# EAGLE design IMU Breakout Board (EAGLE 9.5.0)
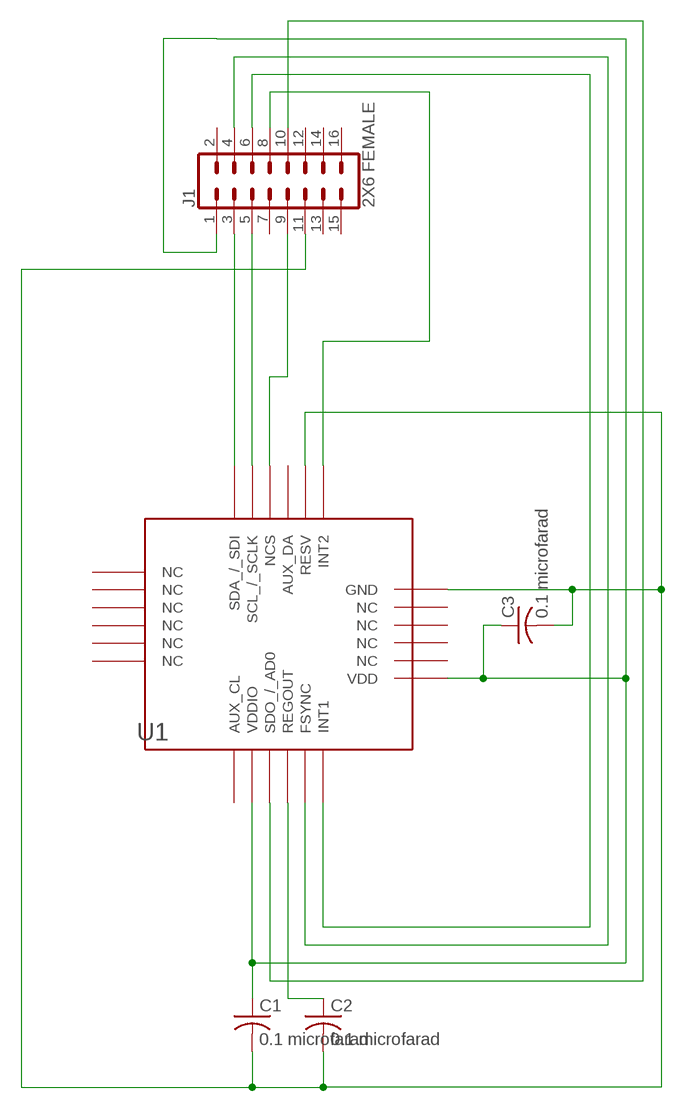
[diagram p0: schematic, sheet 1]

## Parts
C1  0.1 microfarad  C-ALL_PACKAGESC1206  [C1206]
C2  0.1 microfarad  C-ALL_PACKAGESC1206  [C1206]
C3  0.1 microfarad  C-ALL_PACKAGESC1206  [C1206]
J1  2X6 FEMALE  SENSOR_BREAKOUTPTH_FEMALE  [2X7]
U1  ICM_20649  [ICM-20649]

## Nets
N$1: J1.4 U1.P4(FSYNC)
N$2: J1.6 U1.P5(INT1)
N$3: J1.8 U1.P6(INT2)
N$4: J1.9 U1.P9(NCS)
N$5: J1.3 U1.P11(SDA_/_SDI)
N$6: J1.5 U1.P10(SCL_/_SCLK)
N$7: J1.10 U1.P2(SDO_/_AD0)
N$8: C1.1 C3.1 J1.1 U1.P1(VDDIO) U1.P18(VDD)
N$9: C2.1 U1.P3(REGOUT)
N$11: C1.2 C2.2 C3.2 J1.11 U1.P7(RESV) U1.P23(GND)
Unconnected: J1.2 J1.7 J1.12 J1.13 J1.14 J1.15 J1.16 U1.P0(AUX_CL) U1.P8(AUX_DA) U1.P12(NC) U1.P13(NC) U1.P14(NC) U1.P15(NC) U1.P16(NC) U1.P17(NC) U1.P19(NC) U1.P20(NC) U1.P21(NC) U1.P22(NC)

## Library data of the parts
C1-C3 = RTR Main Library:C-ALL_PACKAGES: CAPACITOR, American symbol
J1 = RTR Main Library:SENSOR_BREAKOUT: .1 inch-spaced 12P sensor breakout Used as a generalized connector for attaching new sensors; PROD_ID: CONN-12423
U1 = IMU_Breakout_SCH_E:ICM_20649

## Board
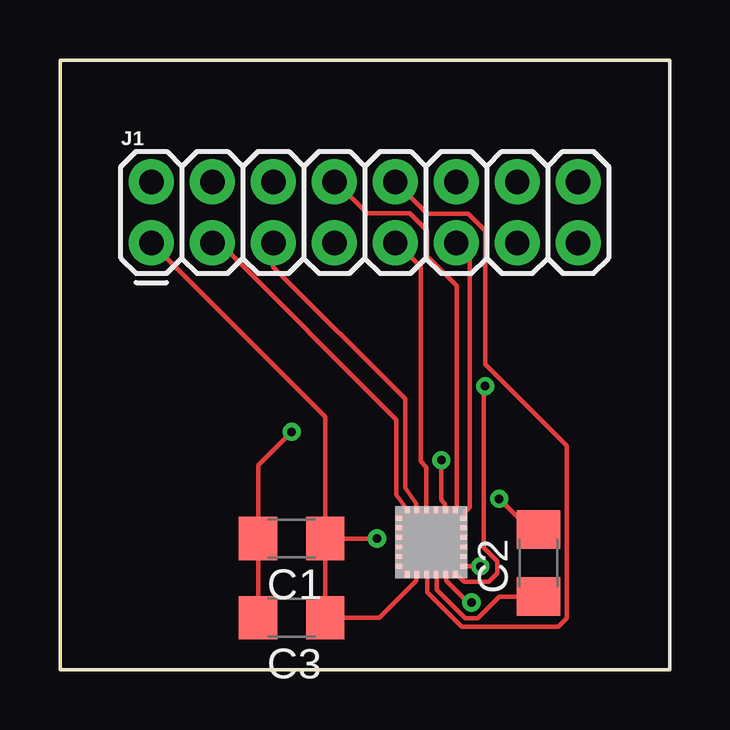
[diagram p1: board, top side]
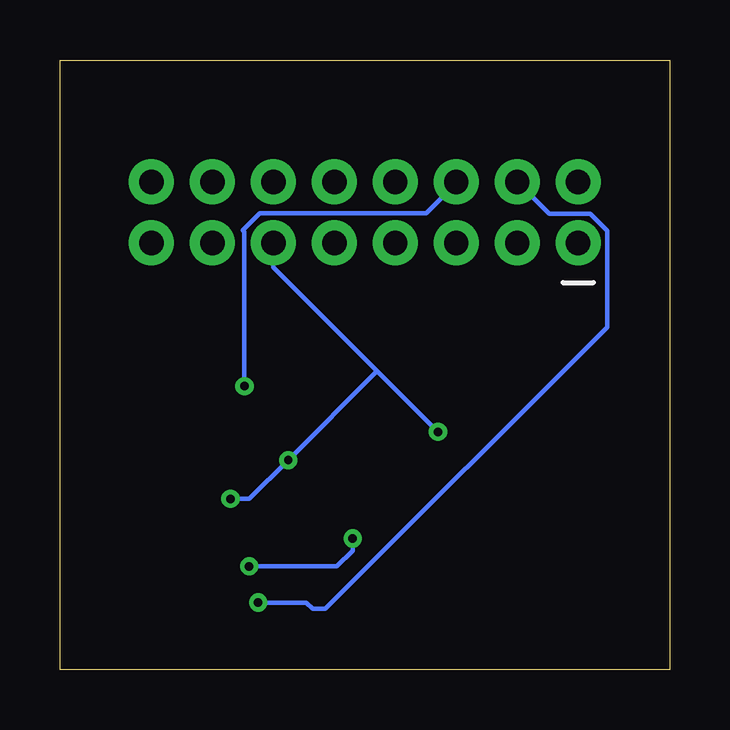
[diagram p2: board, bottom side, seen from below]

Size 25.4 x 25.4 mm. Coordinates in mm from the lower left corner, seen from the top.
Outline: 0,0 25.4,0 25.4,25.4 0,25.4 0,0
Copper layers (1*16): Top 0.035mm / dielectric 1.5mm / Bottom 0.035mm
Design rules "Bantam PCB Mill Design Rules *": minimum track width 7mil, minimum drill 11mil, track to track 7mil, track to pad 7mil, pad to pad 5mil, via to via 7mil, smd to smd 5mil, copper to edge 40mil, drill to drill 6mil, minimum pad ring 10mil, minimum via ring 8mil, stop-mask expansion 4mil, vias tented up to drill 0mil, thermal gap 10mil

### Footprints (pad centres in the part's own frame; a part is rotated, then mirrored left to right if it is on the bottom)
C1206 = smd 1.6 x 1.8: 1 -1.4,0; 2 1.4,0
2X7 = drill 1.016 pad 1.88: 1 -8.89,5.08; 2 -8.89,7.62; 3 -6.35,5.08; 4 -6.35,7.62; 5 -3.81,5.08; 6 -3.81,7.62; 7 -1.27,5.08; 8 -1.27,7.62; 9 1.27,5.08; 10 1.27,7.62; 11 3.81,5.08; 12 3.81,7.62; 13 6.35,5.08; 14 6.35,7.62; 15 8.89,5.08; 16 8.89,7.62
ICM-20649 = smd 0.2 x 0.3: P0 0.5,0.15; P1 0.9,0.15; P2 1.3,0.15; P3 1.7,0.15; P4 2.1,0.15; P5 2.5,0.15; P6 2.5,2.85; P7 2.1,2.85; P8 1.7,2.85; P9 1.3,2.85; P10 0.9,2.85; P11 0.5,2.85 | smd 0.3 x 0.2: P12 0.15,2.5; P13 0.15,2.1; P14 0.15,1.7; P15 0.15,1.3; P16 0.15,0.9; P17 0.15,0.5; P18 2.85,0.5; P19 2.85,0.9; P20 2.85,1.3; P21 2.85,1.7; P22 2.85,2.1; P23 2.85,2.5

### Placement (x,y rotation side)
C1  9.65,5.46 180 top
C2  19.94,4.45 90 top
C3  9.65,2.16 180 top
J1  12.7,12.7 0 top
U1  13.97,3.81 0 top

### Tracks (layer width: path | path; a pad name or v marks a point on that pad's centre or on a via)
N$1  (via drill 0.35)
  Top 0.178: U1.P4 16.1,3.93 16.1,3.7 17.01,2.79 v17.14,2.79
  Bottom 0.178: v17.14,2.79 15.14,2.79 14.87,2.53 14.34,2.53 2.6,14.26 2.6,18.28 3.31,18.99 5.02,18.99 J1.4
N$2  (via drill 0.35)
  Top 0.178: U1.P5 16.54,3.96 16.84,3.66 17.86,3.66 18.21,4.01 18.21,4.52 17.65,5.08 17.65,11.75 v17.71,11.81
  Bottom 0.178: J1.6 8.89,20.27 10.13,19.02 17.07,19.02 17.78,18.31 17.72,18.25 17.72,17.28 17.71,17.28 v17.71,11.81
N$3
  Top 0.178: U1.P6 16.54,6.76 16.54,16 15.29,17.25 15.29,18.31 14.58,19.02 12.8,19.02 11.56,20.27 J1.8
N$4
  Top 0.178: U1.P9 15.27,8.44 15.04,8.67 15.04,16.79 14.05,17.78 J1.9
N$5
  Top 0.178: J1.3 6.66,17.78 14.02,10.41 14.02,7.29 U1.P11
N$6
  Top 0.178: U1.P10 14.84,6.69 14.84,6.7 14.85,6.75 14.84,6.76 14.84,6.92 14.38,7.57 14.38,11.28 8.89,16.76 J1.5
N$7
  Top 0.178: J1.10 15.3,18.99 17.01,18.99 17.72,18.28 17.72,12.72 21.11,9.33 21.11,2.13 20.77,1.79 16.73,1.79 15.3,3.22 15.3,3.93 U1.P2
N$8  (via drill 0.35)
  Top 0.178: U1.P1 14.84,3.93 14.84,3.7 13.3,2.16 C3.1 C1.1 | U1.P18 v17.51,4.31 v17.52,4.3 | v13.21,5.46 C1.1 | J1.1 11.05,10.54 C1.1
  Bottom 0.178: v17.52,4.3 13.86,4.3 13.21,4.95 v13.21,5.46
N$9
  Top 0.178: U1.P3 15.7,3.93 15.7,3.32 16.88,2.15 17.41,2.15 18.31,3.04 C2.1
N$11  (via drill 0.35)
  Top 0.178: U1.P23 16.89,6.4 16.89,6.58 17.07,6.76 17.07,17.25 16.54,17.78 J1.11 | v9.65,9.91 8.25,8.51 C1.2 C3.2 | U1.P7 16.04,6.69 16.04,6.92 15.89,7.07 v15.89,8.73 | C2.2 19.57,5.84 v18.3,7.11
  Bottom 0.178: v9.65,9.91 12.19,12.45 | 12.19,12.45 16.51,16.76 J1.11 | 12.19,12.45 12.19,12.43 v15.89,8.73 17.51,7.11 v18.3,7.11